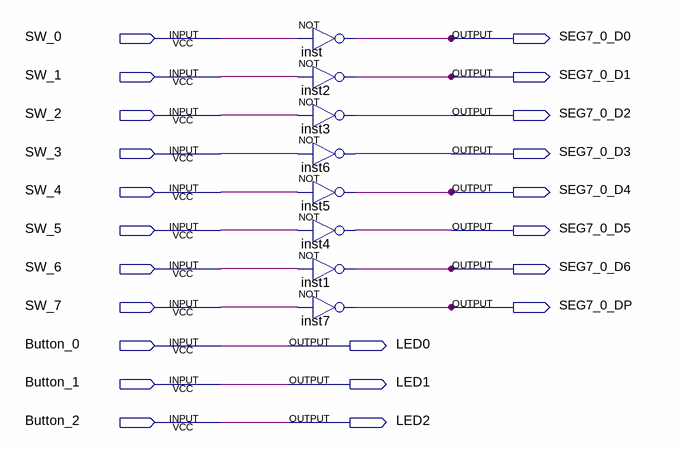
[diagram p0: schematic sheet]
// Quartus schematic Lab1.bdf as structural Verilog: 8 symbols, 22 pins
module Lab1 (
  input  SW_0,
  input  SW_1,
  input  SW_2,
  input  SW_3,
  input  SW_4,
  input  SW_5,
  input  SW_6,
  input  SW_7,
  input  Button_0,
  input  Button_1,
  input  Button_2,
  output SEG7_0_D0,
  output SEG7_0_D1,
  output SEG7_0_D2,
  output SEG7_0_D3,
  output SEG7_0_D4,
  output SEG7_0_D5,
  output SEG7_0_D6,
  output SEG7_0_DP,
  output LED0,
  output LED1,
  output LED2
);

  not inst (SEG7_0_D0, SW_0);
  not inst2 (SEG7_0_D1, SW_1);
  not inst3 (SEG7_0_D2, SW_2);
  not inst6 (SEG7_0_D3, SW_3);
  not inst5 (SEG7_0_D4, SW_4);
  not inst4 (SEG7_0_D5, SW_5);
  not inst1 (SEG7_0_D6, SW_6);
  not inst7 (SEG7_0_DP, SW_7);

  assign LED0 = Button_0;
  assign LED1 = Button_1;
  assign LED2 = Button_2;
endmodule
